# EAGLE design cft-tty-board (EAGLE 5.11)
DRAWN_BY: Alexios; PROJECT_NAME: CFT Mini-Computer; REVISION: Rev A; SHEET_DESCRIPTION: RS-232 Ports (16C550 UARTs); SIMULATION_FILENAME: To be coded; URL: http://www.bedroomlan.org/cft

## Sheet 1 of 3
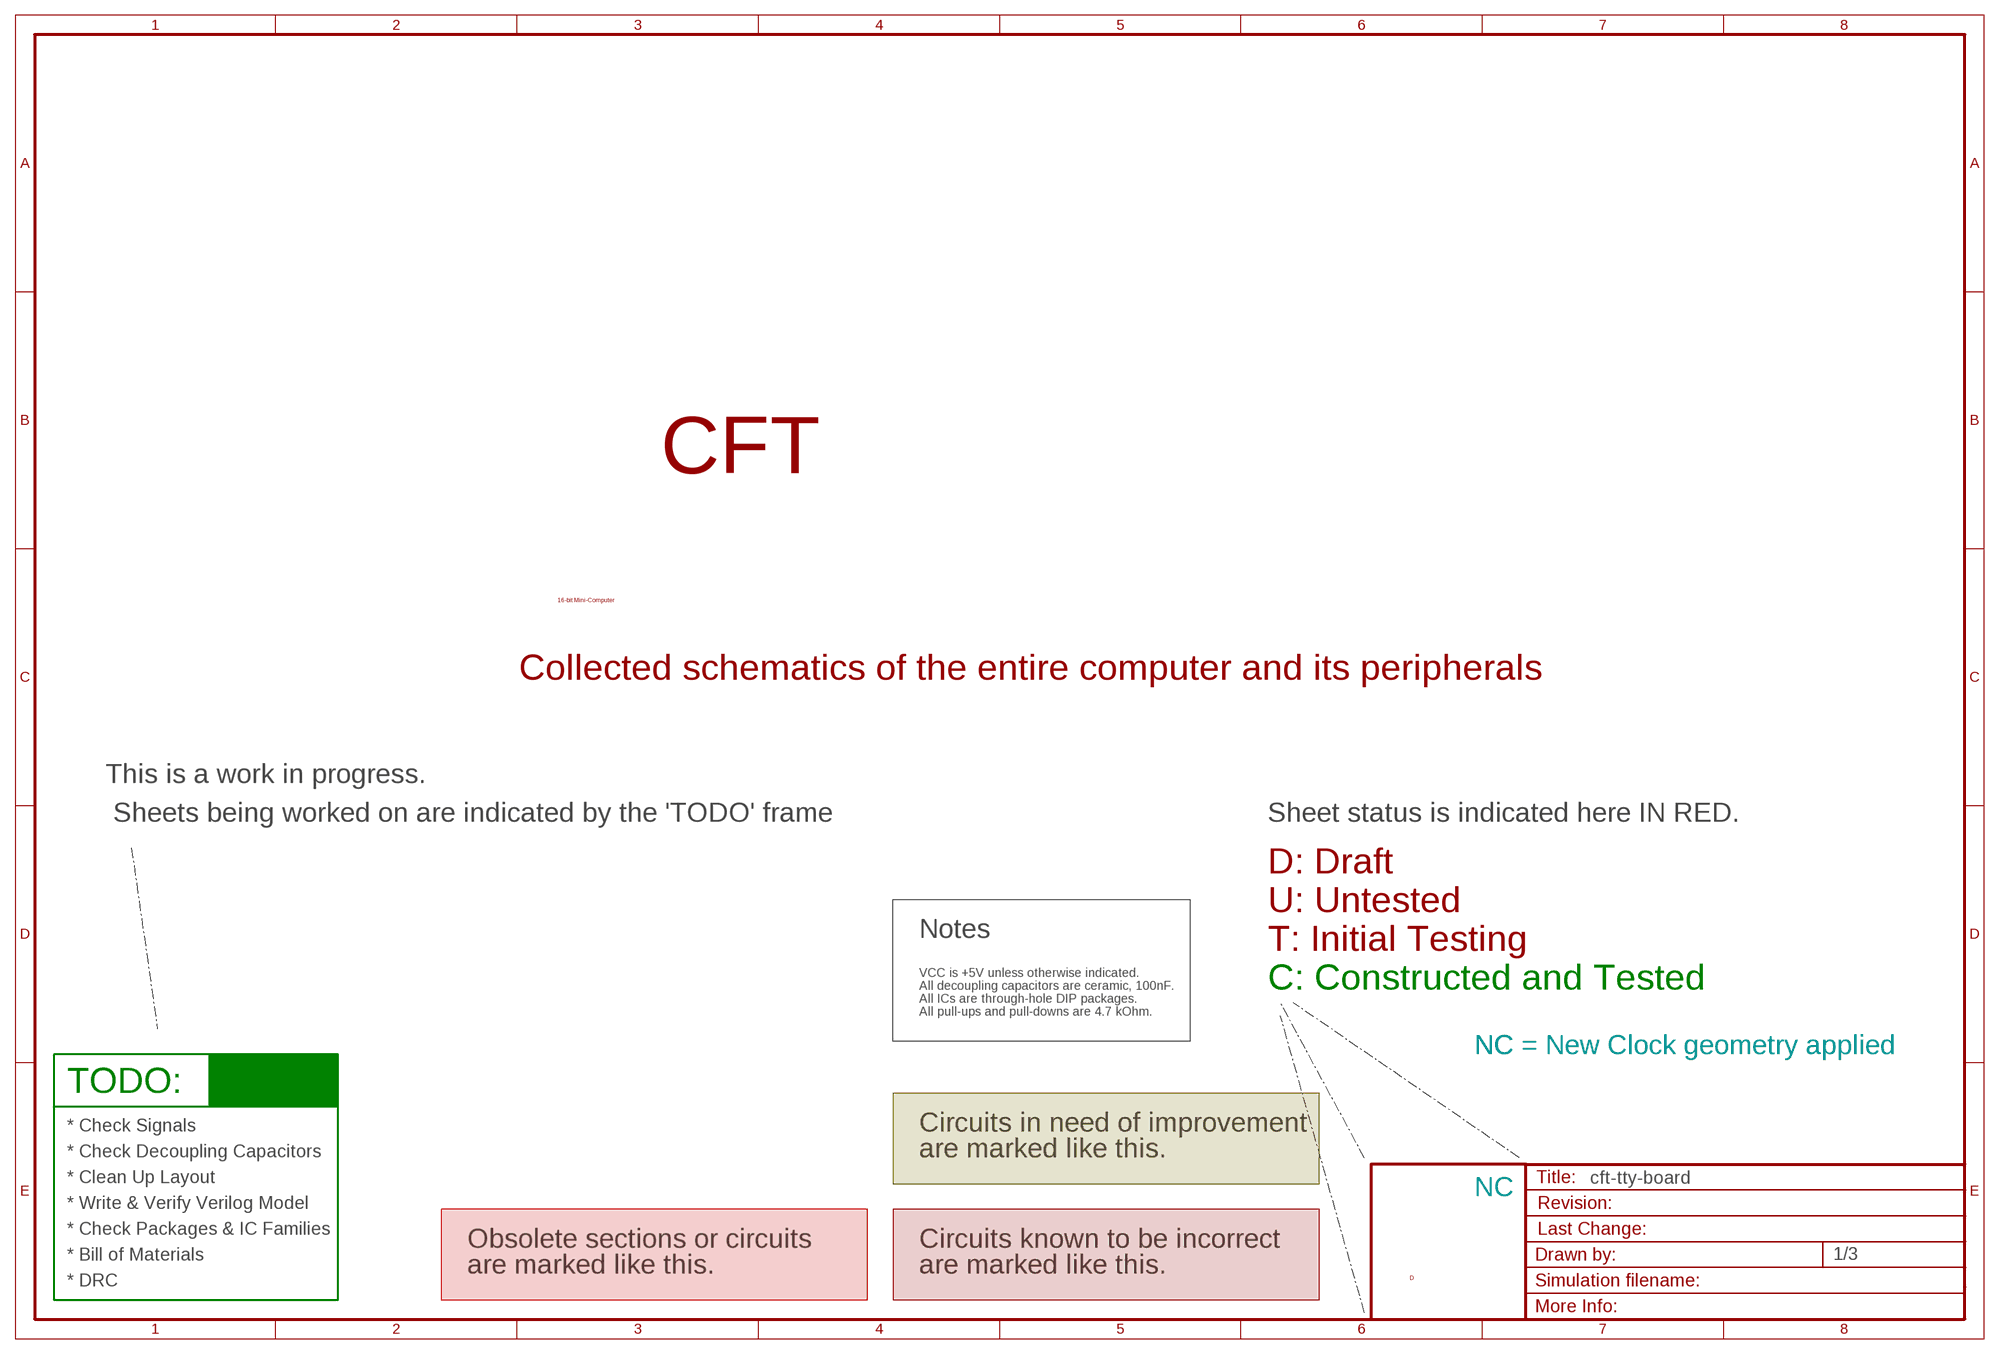
[diagram p0: schematic, sheet 1]

### Notes on the sheet
- CFT
- 16-bit Mini-Computer
- Collected schematics of the entire computer and its peripherals
- This is a work in progress.
- Sheets being worked on are indicated by the 'TODO' frame | Sheet status is indicated here IN RED.
- D: Draft
- U: Untested
- Notes
- T: Initial Testing
- VCC is +5V unless otherwise indicated.
- All decoupling capacitors are ceramic, 100nF. | C: Constructed and Tested
- All ICs are through-hole DIP packages.
- All pull-ups and pull-downs are 4.7 kOhm.
- NC | NC = New Clock geometry applied
- TODO:
- * Check Signals | Circuits in need of improvement
- * Check Decoupling Capacitors | are marked like this.
- * Clean Up Layout
- NC
- * Write & Verify Verilog Model
- * Check Packages & IC Families
- Obsolete sections or circuits | Circuits known to be incorrect
- * Bill of Materials
- are marked like this. | are marked like this.
- D
- * DRC

## Sheet 2 of 3
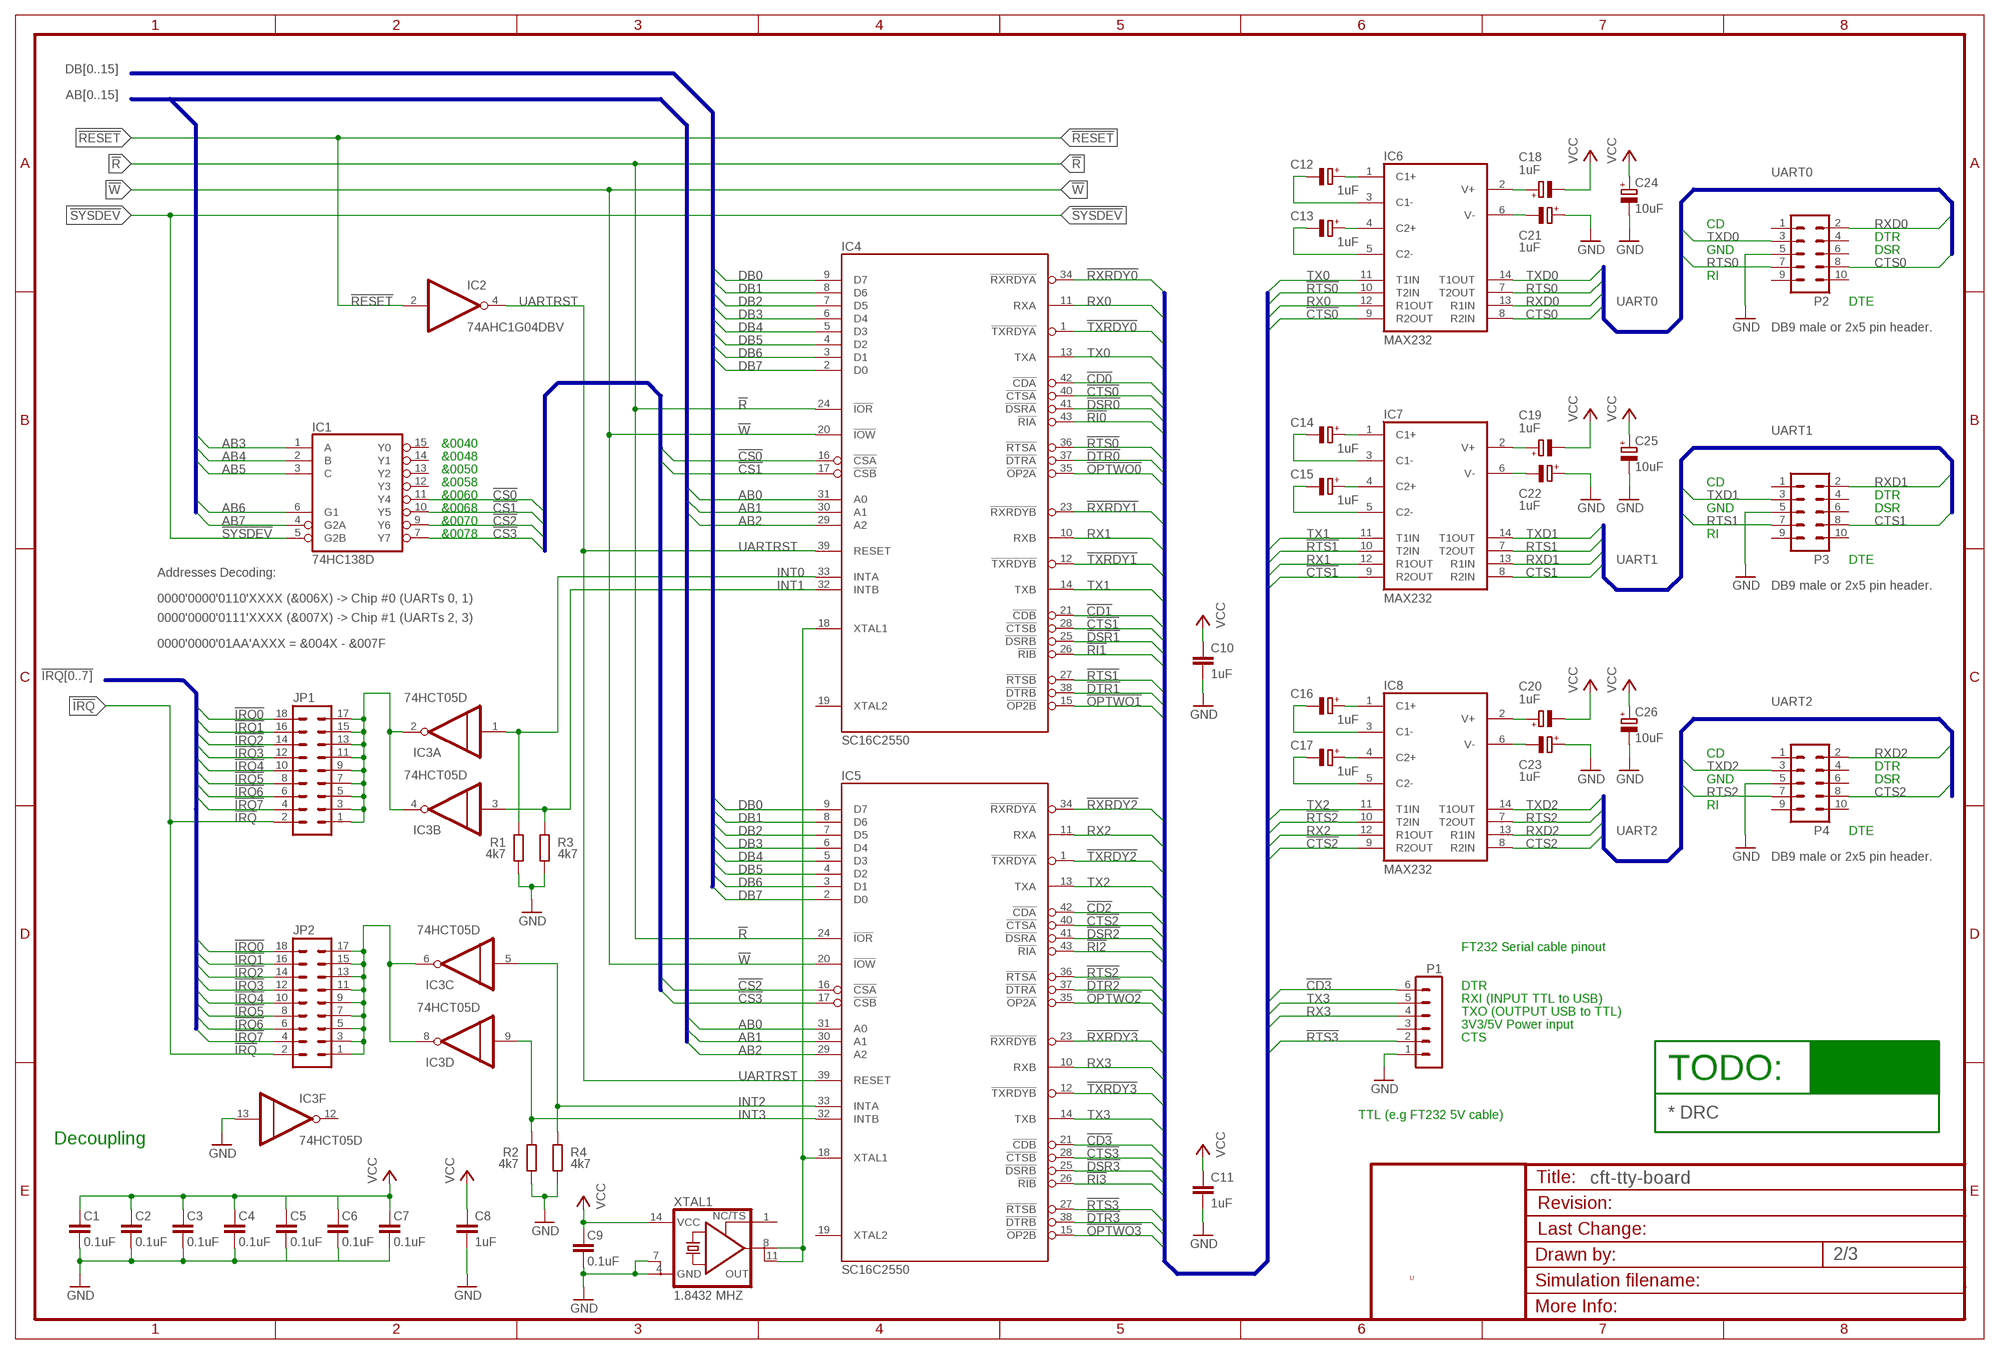
[diagram p1: schematic, sheet 2]

### Parts
C1  0.1uF  C-EUC0805K  [C0805K]
C2  0.1uF  C-EUC0805K  [C0805K]
C3  0.1uF  C-EUC0805K  [C0805K]
C4  0.1uF  C-EUC0805K  [C0805K]
C5  0.1uF  C-EUC0805K  [C0805K]
C6  0.1uF  C-EUC0805K  [C0805K]
C7  0.1uF  C-EUC0805K  [C0805K]
C8  1uF  C-EUC0805K  [C0805K]
C9  0.1uF  C-EUC0805K  [C0805K]
C10  1uF  C-EUC0805K  [C0805K]
C11  1uF  C-EUC0805K  [C0805K]
C12  1uF  CPOL-EUE2.5-5  [E2,5-5]
C13  1uF  CPOL-EUE2.5-5  [E2,5-5]
C14  1uF  CPOL-EUE2.5-5  [E2,5-5]
C15  1uF  CPOL-EUE2.5-5  [E2,5-5]
C16  1uF  CPOL-EUE2.5-5  [E2,5-5]
C17  1uF  CPOL-EUE2.5-5  [E2,5-5]
C18  1uF  CPOL-EUE2.5-5  [E2,5-5]
C19  1uF  CPOL-EUE2.5-5  [E2,5-5]
C20  1uF  CPOL-EUE2.5-5  [E2,5-5]
C21  1uF  CPOL-EUE2.5-5  [E2,5-5]
C22  1uF  CPOL-EUE2.5-5  [E2,5-5]
C23  1uF  CPOL-EUE2.5-5  [E2,5-5]
C24  10uF  CPOL-EUE2.5-5  [E2,5-5]
C25  10uF  CPOL-EUE2.5-5  [E2,5-5]
C26  10uF  CPOL-EUE2.5-5  [E2,5-5]
IC1  74HC138D  [SO16]
IC2  74AHC1G04DBV  [SOT23-5]
IC3  74HCT05D  [SO14]
IC4  SC16C2550  16C2550  [PLCC-S44-SOCKET]
IC5  SC16C2550  16C2550  [PLCC-S44-SOCKET]
IC6  MAX232  [DIL16]
IC7  MAX232  [DIL16]
IC8  MAX232  [DIL16]
JP1  MA09-2  [MA09-2]
JP2  MA09-2  [MA09-2]
P1  MA06-1  [MA06-1]
P2  MA05-2  [MA05-2]
P3  MA05-2  [MA05-2]
P4  MA05-2  [MA05-2]
R1  4k7  R-EU_M0805  [M0805]
R2  4k7  R-EU_M0805  [M0805]
R3  4k7  R-EU_M0805  [M0805]
R4  4k7  R-EU_M0805  [M0805]
XTAL1  1.8432 MHZ  XO2-08-14-SOCKET  [DIL0814S]

### Nets
!CD0: IC4.42(!CDA)
!CD1: IC4.21(!CDB)
!CD2: IC5.42(!CDA)
!CD3: IC5.21(!CDB) P1.6
!CS0: IC1.11(Y4) IC4.16(!CSA)
!CS1: IC1.10(Y5) IC4.17(!CSB)
!CS2: IC1.9(Y6) IC5.16(!CSA)
!CS3: IC1.7(Y7) IC5.17(!CSB)
!CTS0: IC4.40(!CTSA) IC6.9(R2OUT)
!CTS1: IC4.28(!CTSB) IC7.9(R2OUT)
!CTS2: IC5.40(!CTSA) IC8.9(R2OUT)
!CTS3: IC5.28(!CTSB)
!DSR0: IC4.41(!DSRA)
!DSR1: IC4.25(!DSRB)
!DSR2: IC5.41(!DSRA)
!DSR3: IC5.25(!DSRB)
!DTR0: IC4.37(!DTRA)
!DTR1: IC4.38(!DTRB)
!DTR2: IC5.37(!DTRA)
!DTR3: IC5.38(!DTRB)
!INTRN0: IC3.2(A:O) IC3.4(B:O) JP1.1 JP1.3 JP1.5 JP1.7 JP1.9 JP1.11 JP1.13 JP1.15 JP1.17
!INTRN1: IC3.6(C:O) IC3.8(D:O) JP2.1 JP2.3 JP2.5 JP2.7 JP2.9 JP2.11 JP2.13 JP2.15 JP2.17
!IRQ: JP1.2 JP2.2 ; also sheet 3
!IRQ0: JP1.18 JP2.18 ; also sheet 3
!IRQ1: JP1.16 JP2.16 ; also sheet 3
!IRQ2: JP1.14 JP2.14 ; also sheet 3
!IRQ3: JP1.12 JP2.12 ; also sheet 3
!IRQ4: JP1.10 JP2.10 ; also sheet 3
!IRQ5: JP1.8 JP2.8 ; also sheet 3
!IRQ6: JP1.6 JP2.6 ; also sheet 3
!IRQ7: JP1.4 JP2.4 ; also sheet 3
!OPTWO0: IC4.35(!OP2A)
!OPTWO1: IC4.15(!OP2B)
!OPTWO2: IC5.35(!OP2A)
!OPTWO3: IC5.15(!OP2B)
!R: IC4.24(!IOR) IC5.24(!IOR) ; also sheet 3
!RESET: IC2.2(I) ; also sheet 3
!RI0: IC4.43(!RIA)
!RI1: IC4.26(!RIB)
!RI2: IC5.43(!RIA)
!RI3: IC5.26(!RIB)
!RTS0: IC4.36(!RTSA) IC6.10(T2IN)
!RTS1: IC4.27(!RTSB) IC7.10(T2IN)
!RTS2: IC5.36(!RTSA) IC8.10(T2IN)
!RTS3: IC5.27(!RTSB) P1.2
!RXRDY0: IC4.34(!RXRDYA)
!RXRDY1: IC4.23(!RXRDYB)
!RXRDY2: IC5.34(!RXRDYA)
!RXRDY3: IC5.23(!RXRDYB)
!SYSDEV: IC1.5(G2B) ; also sheet 3
!TXRDY0: IC4.1(!TXRDYA)
!TXRDY1: IC4.12(!TXRDYB)
!TXRDY2: IC5.1(!TXRDYA)
!TXRDY3: IC5.12(!TXRDYB)
!W: IC4.20(!IOW) IC5.20(!IOW) ; also sheet 3
AB0: IC4.31(A0) IC5.31(A0) ; also sheet 3
AB1: IC4.30(A1) IC5.30(A1) ; also sheet 3
AB2: IC4.29(A2) IC5.29(A2) ; also sheet 3
AB3: IC1.1(A) ; also sheet 3
AB4: IC1.2(B) ; also sheet 3
AB5: IC1.3(C) ; also sheet 3
AB6: IC1.6(G1) ; also sheet 3
AB7: IC1.4(G2A) ; also sheet 3
CTS0: IC6.8(R2IN) P2.8
CTS1: IC7.8(R2IN) P3.8
CTS2: IC8.8(R2IN) P4.8
DB0: IC4.9(D7) IC5.9(D7) ; also sheet 3
DB1: IC4.8(D6) IC5.8(D6) ; also sheet 3
DB2: IC4.7(D5) IC5.7(D5) ; also sheet 3
DB3: IC4.6(D4) IC5.6(D4) ; also sheet 3
DB4: IC4.5(D3) IC5.5(D3) ; also sheet 3
DB5: IC4.4(D2) IC5.4(D2) ; also sheet 3
DB6: IC4.3(D1) IC5.3(D1) ; also sheet 3
DB7: IC4.2(D0) IC5.2(D0) ; also sheet 3
GND [low power]: C1.1 C2.1 C3.1 C4.1 C5.1 C6.1 C7.1 C8.2 C9.1 C10.2 C11.2 C21.+ C22.+ C23.+ C24.- C25.- C26.- IC3.13(F:I) P1.1 P2.5 P3.5 P4.5 R1.1 R2.1 R3.1 R4.1 XTAL1.4(GND) XTAL1.7(GND1) ; also sheet 3
INT0: IC3.1(A:I) IC4.33(INTA) R1.2
INT1: IC3.3(B:I) IC4.32(INTB) R3.2
INT2: IC3.5(C:I) IC5.33(INTA) R4.2
INT3: IC3.9(D:I) IC5.32(INTB) R2.2
N$829: C12.+ IC6.1(C1+)
N$830: C12.- IC6.3(C1-)
N$831: C13.+ IC6.4(C2+)
N$832: C13.- IC6.5(C2-)
N$833: C21.- IC6.6(V-)
N$834: C18.+ IC6.2(V+)
N$836: C14.+ IC7.1(C1+)
N$837: C14.- IC7.3(C1-)
N$838: C15.+ IC7.4(C2+)
N$839: C15.- IC7.5(C2-)
N$840: C22.- IC7.6(V-)
N$841: C19.+ IC7.2(V+)
N$851: C16.+ IC8.1(C1+)
N$852: C16.- IC8.3(C1-)
N$853: C17.+ IC8.4(C2+)
N$854: C17.- IC8.5(C2-)
N$855: C23.- IC8.6(V-)
N$856: C20.+ IC8.2(V+)
RTS0: IC6.7(T2OUT) P2.7
RTS1: IC7.7(T2OUT) P3.7
RTS2: IC8.7(T2OUT) P4.7
RX0: IC4.11(RXA) IC6.12(R1OUT)
RX1: IC4.10(RXB) IC7.12(R1OUT)
RX2: IC5.11(RXA) IC8.12(R1OUT)
RX3: IC5.10(RXB) P1.4
RXD0: IC6.13(R1IN) P2.2
RXD1: IC7.13(R1IN) P3.2
RXD2: IC8.13(R1IN) P4.2
TX0: IC4.13(TXA) IC6.11(T1IN)
TX1: IC4.14(TXB) IC7.11(T1IN)
TX2: IC5.13(TXA) IC8.11(T1IN)
TX3: IC5.14(TXB) P1.5
TXD0: IC6.14(T1OUT) P2.3
TXD1: IC7.14(T1OUT) P3.3
TXD2: IC8.14(T1OUT) P4.3
UARTCLK: IC4.18(XTAL1) IC5.18(XTAL1) XTAL1.8(OUT) XTAL1.11(OUT1)
UARTRST: IC2.4(O) IC4.39(RESET) IC5.39(RESET)
VCC [low power]: C1.2 C2.2 C3.2 C4.2 C5.2 C6.2 C7.2 C8.1 C9.2 C10.1 C11.1 C18.- C19.- C20.- C24.+ C25.+ C26.+ XTAL1.14(VCC) ; also sheet 3
Unconnected: IC1.12(Y3) IC1.13(Y2) IC1.14(Y1) IC1.15(Y0) IC3.10(E:O) IC3.11(E:I) IC3.12(F:O) IC4.19(XTAL2) IC5.19(XTAL2) P1.3 P2.1 P2.4 P2.6 P2.9 P2.10 P3.1 P3.4 P3.6 P3.9 P3.10 P4.1 P4.4 P4.6 P4.9 P4.10 XTAL1.1(TS)

### Buses
DB[0..15]
AB[0..15]
!IRQ[0..7]
UART0
UART1
UART2
!CS[0..3]
!RXRDY[0..3],!TXRDY[0..3],RX[0..3],TX[0..3],!CD[0..3],!CTS[0..3],!DSR[0..3],!RI[0..3],!RTS[0..3],!DTR[0..3],!OPTWO[0..3]

### Notes on the sheet
- CD
- DTR
- GND | DSR
- RI
- DTE
- DB9 male or 2x5 pin header.
- &0040
- &0048
- &0050
- &0058 | CD
- &0060 | DTR
- &0068 | GND | DSR
- &0070
- &0078 | RI
- DTE
- Addresses Decoding:
- DB9 male or 2x5 pin header.
- 0000'0000'0110'XXXX (&006X) -> Chip #0 (UARTs 0, 1)
- 0000'0000'0111'XXXX (&007X) -> Chip #1 (UARTs 2, 3)
- 0000'0000'01AA'AXXX = &004X - &007F
- CD
- DTR
- GND | DSR
- RI
- DTE
- DB9 male or 2x5 pin header.
- FT232 Serial cable pinout
- DTR
- RXI (INPUT TTL to USB)
- TXO (OUTPUT USB to TTL)
- 3V3/5V Power input
- CTS
- TODO:
- TTL (e.g FT232 5V cable) | * DRC
- Decoupling
- U

## Sheet 3 of 3
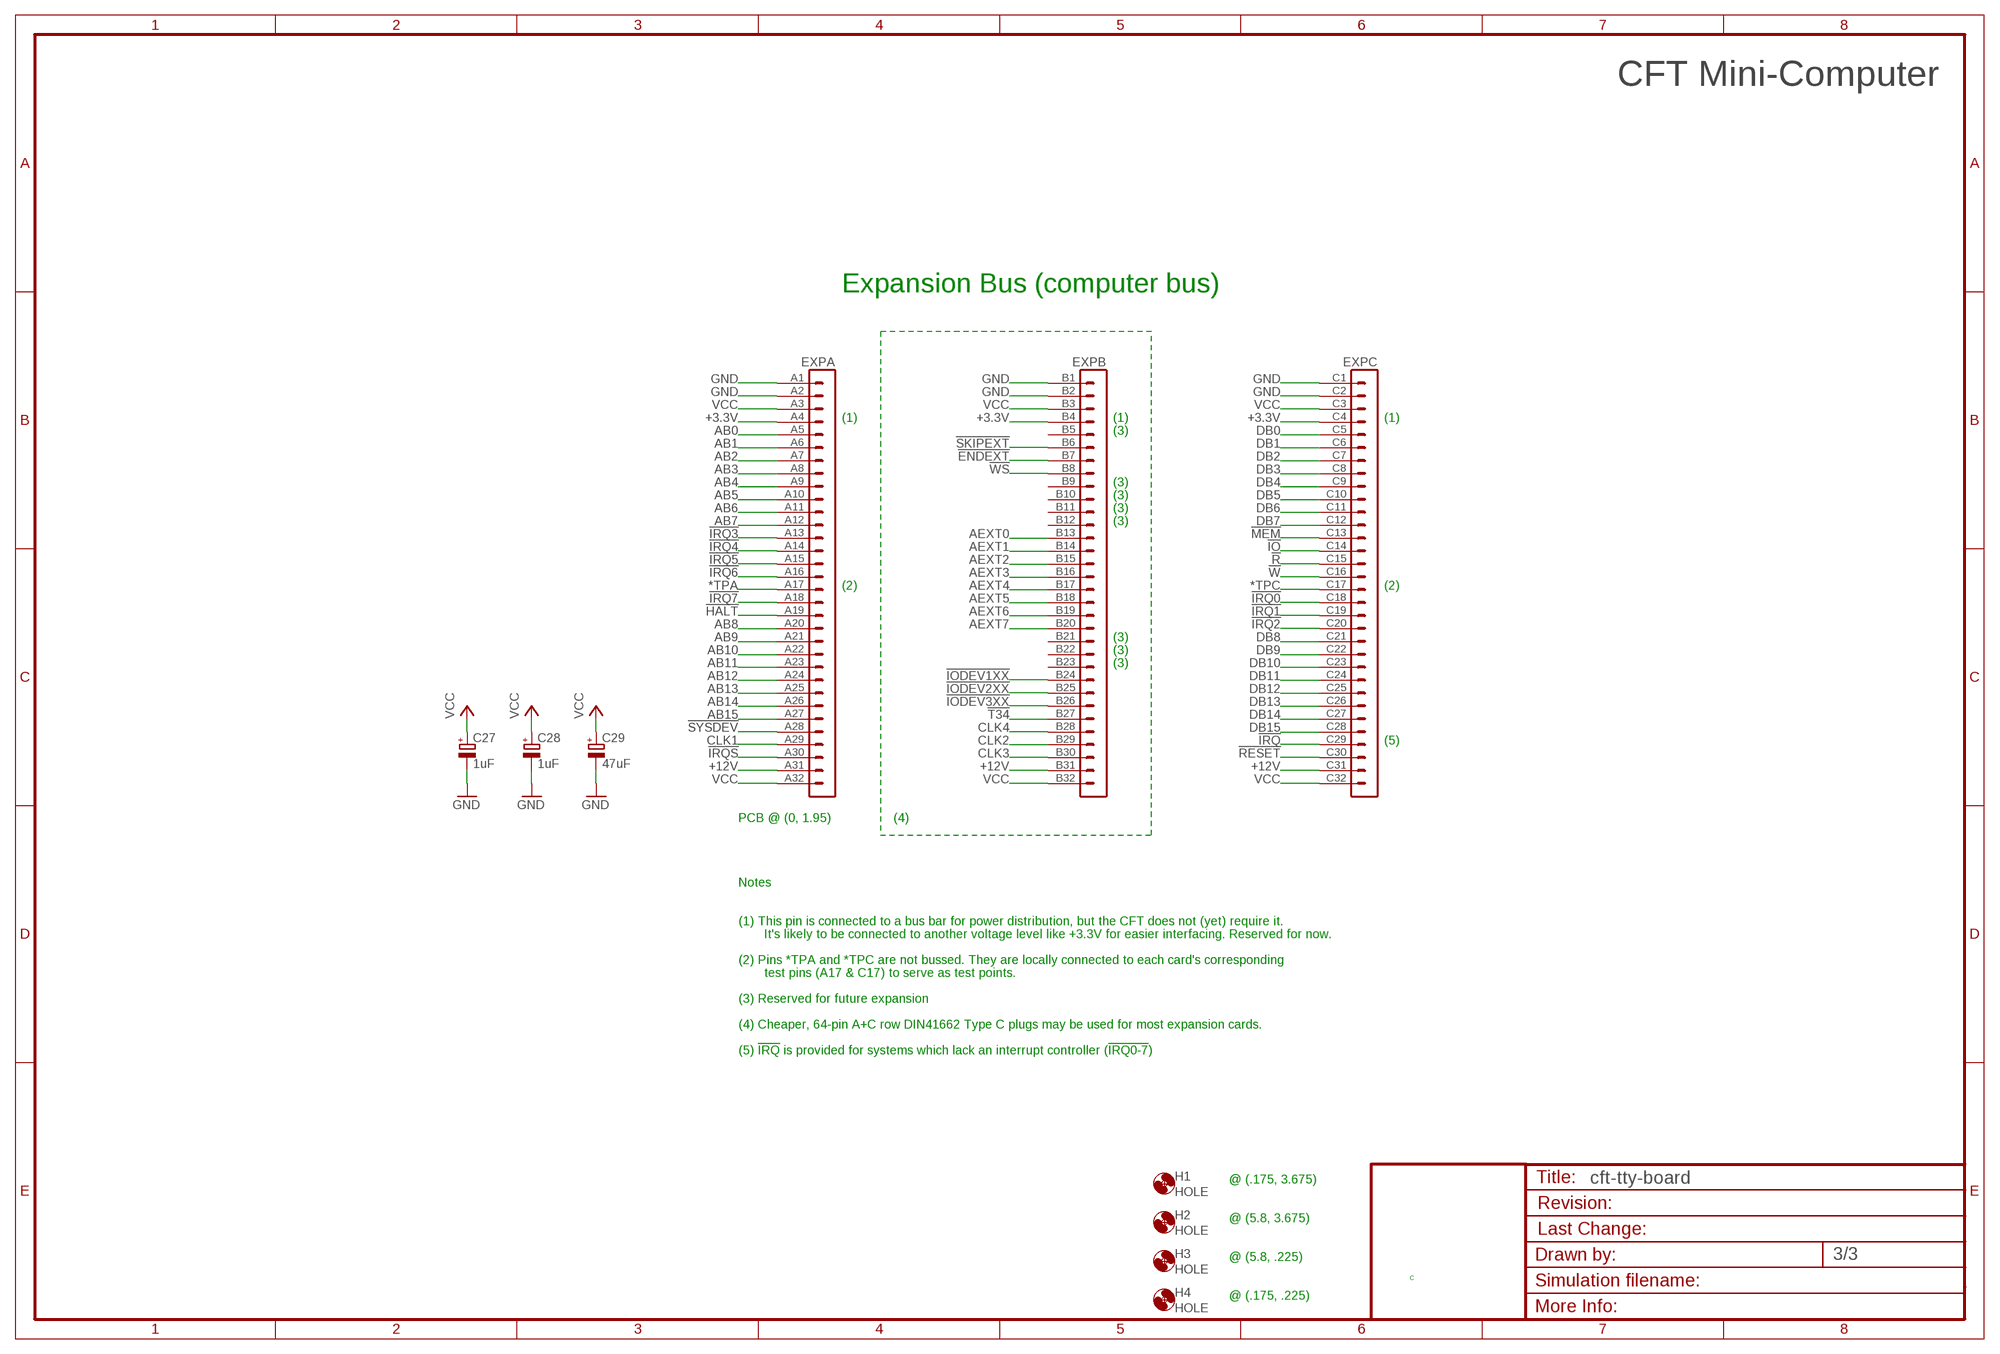
[diagram p2: schematic, sheet 3]

### Parts
C27  1uF  CPOL-EUE2.5-5  [E2,5-5]
C28  1uF  CPOL-EUE2.5-5  [E2,5-5]
C29  47uF  CPOL-EUE2.5-5  [E2,5-5]
EXP  VG96-3K  [VG96K]
H1  HOLE  [STANDOFF_28_60]
H2  HOLE  [STANDOFF_28_60]
H3  HOLE  [STANDOFF_28_60]
H4  HOLE  [STANDOFF_28_60]

### Nets
!ENDEXT: EXP.B7
!HALT: EXP.A19
!IO: EXP.C14
!IODEV1XX: EXP.B24
!IODEV2XX: EXP.B25
!IODEV3XX: EXP.B26
!IRQ: EXP.C29 ; also sheet 2
!IRQ0: EXP.C18 ; also sheet 2
!IRQ1: EXP.C19 ; also sheet 2
!IRQ2: EXP.C20 ; also sheet 2
!IRQ3: EXP.A13 ; also sheet 2
!IRQ4: EXP.A14 ; also sheet 2
!IRQ5: EXP.A15 ; also sheet 2
!IRQ6: EXP.A16 ; also sheet 2
!IRQ7: EXP.A18 ; also sheet 2
!IRQS: EXP.A30
!MEM: EXP.C13
!R: EXP.C15 ; also sheet 2
!RESET: EXP.C30 ; also sheet 2
!SKIPEXT: EXP.B6
!SYSDEV: EXP.A28 ; also sheet 2
!T34: EXP.B27
!W: EXP.C16 ; also sheet 2
!WS: EXP.B8
*TPA: EXP.A17
*TPC: EXP.C17
+3.3V: EXP.A4 EXP.B4 EXP.C4
+12V [LED power]: EXP.A31 EXP.B31 EXP.C31
AB0: EXP.A5 ; also sheet 2
AB1: EXP.A6 ; also sheet 2
AB2: EXP.A7 ; also sheet 2
AB3: EXP.A8 ; also sheet 2
AB4: EXP.A9 ; also sheet 2
AB5: EXP.A10 ; also sheet 2
AB6: EXP.A11 ; also sheet 2
AB7: EXP.A12 ; also sheet 2
AB8: EXP.A20
AB9: EXP.A21
AB10: EXP.A22
AB11: EXP.A23
AB12: EXP.A24
AB13: EXP.A25
AB14: EXP.A26
AB15: EXP.A27
AEXT0: EXP.B13
AEXT1: EXP.B14
AEXT2: EXP.B15
AEXT3: EXP.B16
AEXT4: EXP.B17
AEXT5: EXP.B18
AEXT6: EXP.B19
AEXT7: EXP.B20
CLK1: EXP.A29
CLK2: EXP.B29
CLK3: EXP.B30
CLK4: EXP.B28
DB0: EXP.C5 ; also sheet 2
DB1: EXP.C6 ; also sheet 2
DB2: EXP.C7 ; also sheet 2
DB3: EXP.C8 ; also sheet 2
DB4: EXP.C9 ; also sheet 2
DB5: EXP.C10 ; also sheet 2
DB6: EXP.C11 ; also sheet 2
DB7: EXP.C12 ; also sheet 2
DB8: EXP.C21
DB9: EXP.C22
DB10: EXP.C23
DB11: EXP.C24
DB12: EXP.C25
DB13: EXP.C26
DB14: EXP.C27
DB15: EXP.C28
GND [low power]: C27.- C28.- C29.- EXP.A1 EXP.A2 EXP.B1 EXP.B2 EXP.C1 EXP.C2 ; also sheet 2
VCC [low power]: C27.+ C28.+ C29.+ EXP.A3 EXP.A32 EXP.B3 EXP.B32 EXP.C3 EXP.C32 ; also sheet 2
Unconnected: EXP.B5 EXP.B9 EXP.B10 EXP.B11 EXP.B12 EXP.B21 EXP.B22 EXP.B23

### Notes on the sheet
- CFT Mini-Computer
- Expansion Bus (computer bus)
- (1) | (1) | (1)
- (3)
- (3)
- (3)
- (3)
- (3)
- (2) | (2)
- (3)
- (3)
- (3)
- (5)
- PCB @ (0, 1.95) | (4)
- Notes
- (1) This pin is connected to a bus bar for power distribution, but the CFT does not (yet) require it.
- It's likely to be connected to another voltage level like +3.3V for easier interfacing. Reserved for now.
- (2) Pins *TPA and *TPC are not bussed. They are locally connected to each card's corresponding
- test pins (A17 & C17) to serve as test points.
- (3) Reserved for future expansion
- (4) Cheaper, 64-pin A+C row DIN41662 Type C plugs may be used for most expansion cards.
- (5) !IRQ! is provided for systems which lack an interrupt controller (!IRQ0-7!)
- @ (.175, 3.675)
- @ (5.8, 3.675)
- @ (5.8, .225)
- C
- @ (.175, .225)

## Power pins joined to a net without a drawn wire
GND: IC1.8(GND) IC2.3(GND) IC3.7(P:GND) IC4.22(GND) IC5.22(GND) IC6.15(GND) IC7.15(GND) IC8.15(GND)
VCC: IC1.16(VCC) IC2.5(VCC) IC3.14(P:VCC) IC4.44(VCC) IC5.44(VCC) IC6.16(VCC) IC7.16(VCC) IC8.16(VCC)

## Library data of the parts
C1-C11 = rcl:C-EU: CAPACITOR, European symbol
C12-C29 = rcl:CPOL-EU: POLARIZED CAPACITOR, European symbol
EXP = alexios-19inch:VG96-3: PCB EUROCARD, 96-pin type C/ABC, 2.54 mm
H1-H4 = alexios:HOLE: Hole for a standoff or mount. Hole diameter: 3.3mm. External Diameter: 6mm.
IC1 = 74xx-eu:74*138: 3-line to 8-line DECODER/DEMULTIPLEXER
IC2 = alexios:74*1G04: INVERTER Gate
IC3 = alexios:74*05: Hex INVERTER, open collector/drain
IC4 IC5 = alexios:16C2550: 16C2550 Dual 16550 UART 5 V, 3.3 V and 2.5 V dual UART, 5 Mbit/s (max.), with 16-byte FIFOs E.g. SC16C2550B.
IC6-IC8 = maxim:MAX232: RS232 TRANSEIVER; MF: MAXIM; MPN: MAX232ACPE+; OC_FARNELL: 9723773; OC_NEWARK: 68K4544
JP1 JP2 = con-lstb:MA09-2: PIN HEADER; OC_FARNELL: unknown; OC_NEWARK: unknown
P1 = con-lstb:MA06-1: PIN HEADER; OC_FARNELL: unknown; OC_NEWARK: unknown
P2-P4 = con-lstb:MA05-2: PIN HEADER; OC_FARNELL: unknown; OC_NEWARK: unknown
R1-R4 = resistor:R-EU_: RESISTOR, European symbol
XTAL1 = alexios:XO2-: Crystal Oscillator Crystal oscillator compatible with both DIL14 and DIL08 packages, with or without sockets.

## Net classes
0 default: width 0.305 mm, clearance 0.203 mm
1 low power: width 1.27 mm, clearance 0.254 mm
2 LED power: width 1.93 mm, clearance 0.254 mm

## Board
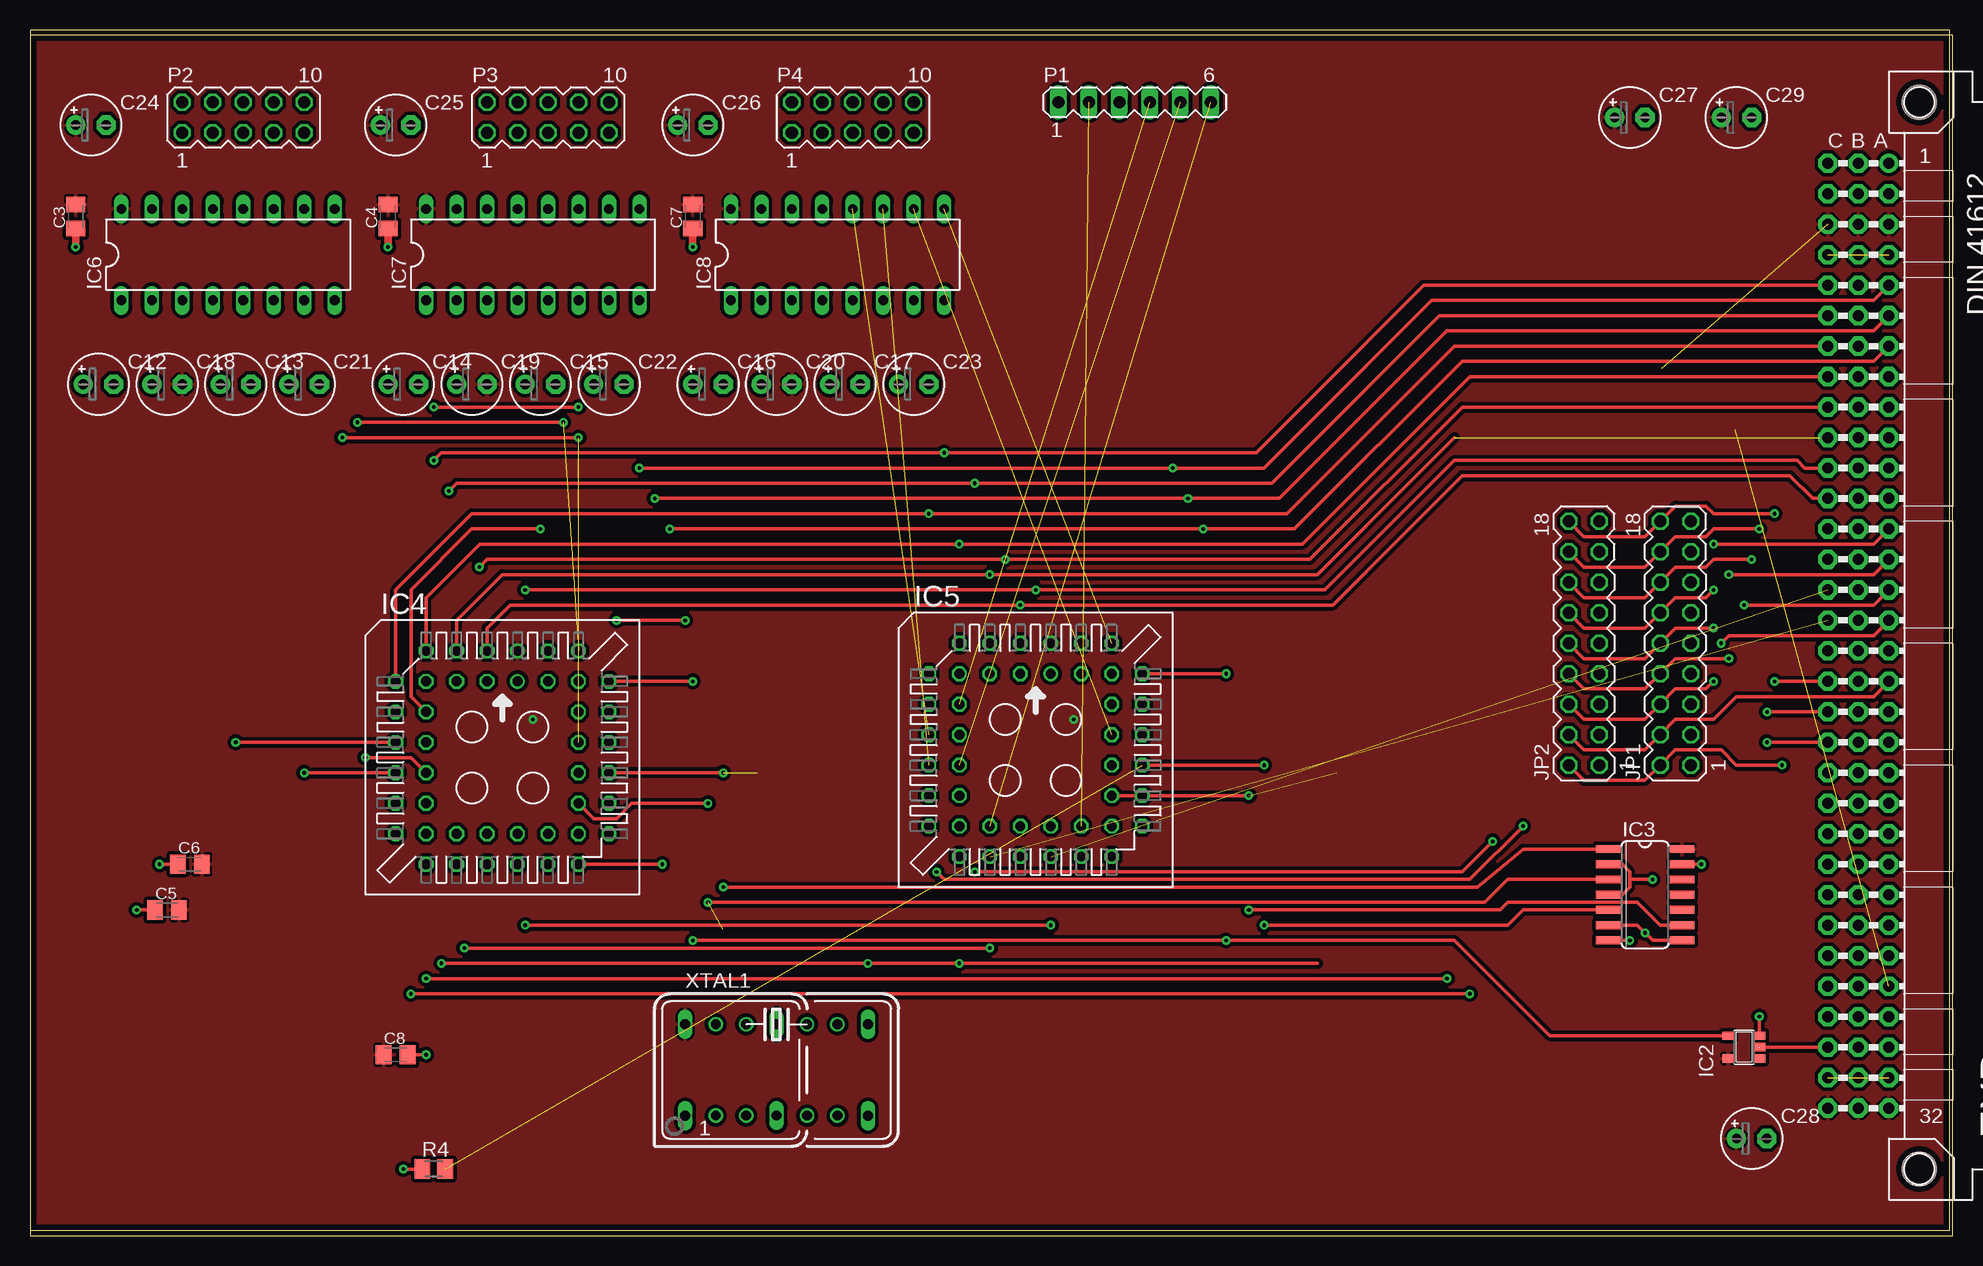
[diagram p3: board, top side]
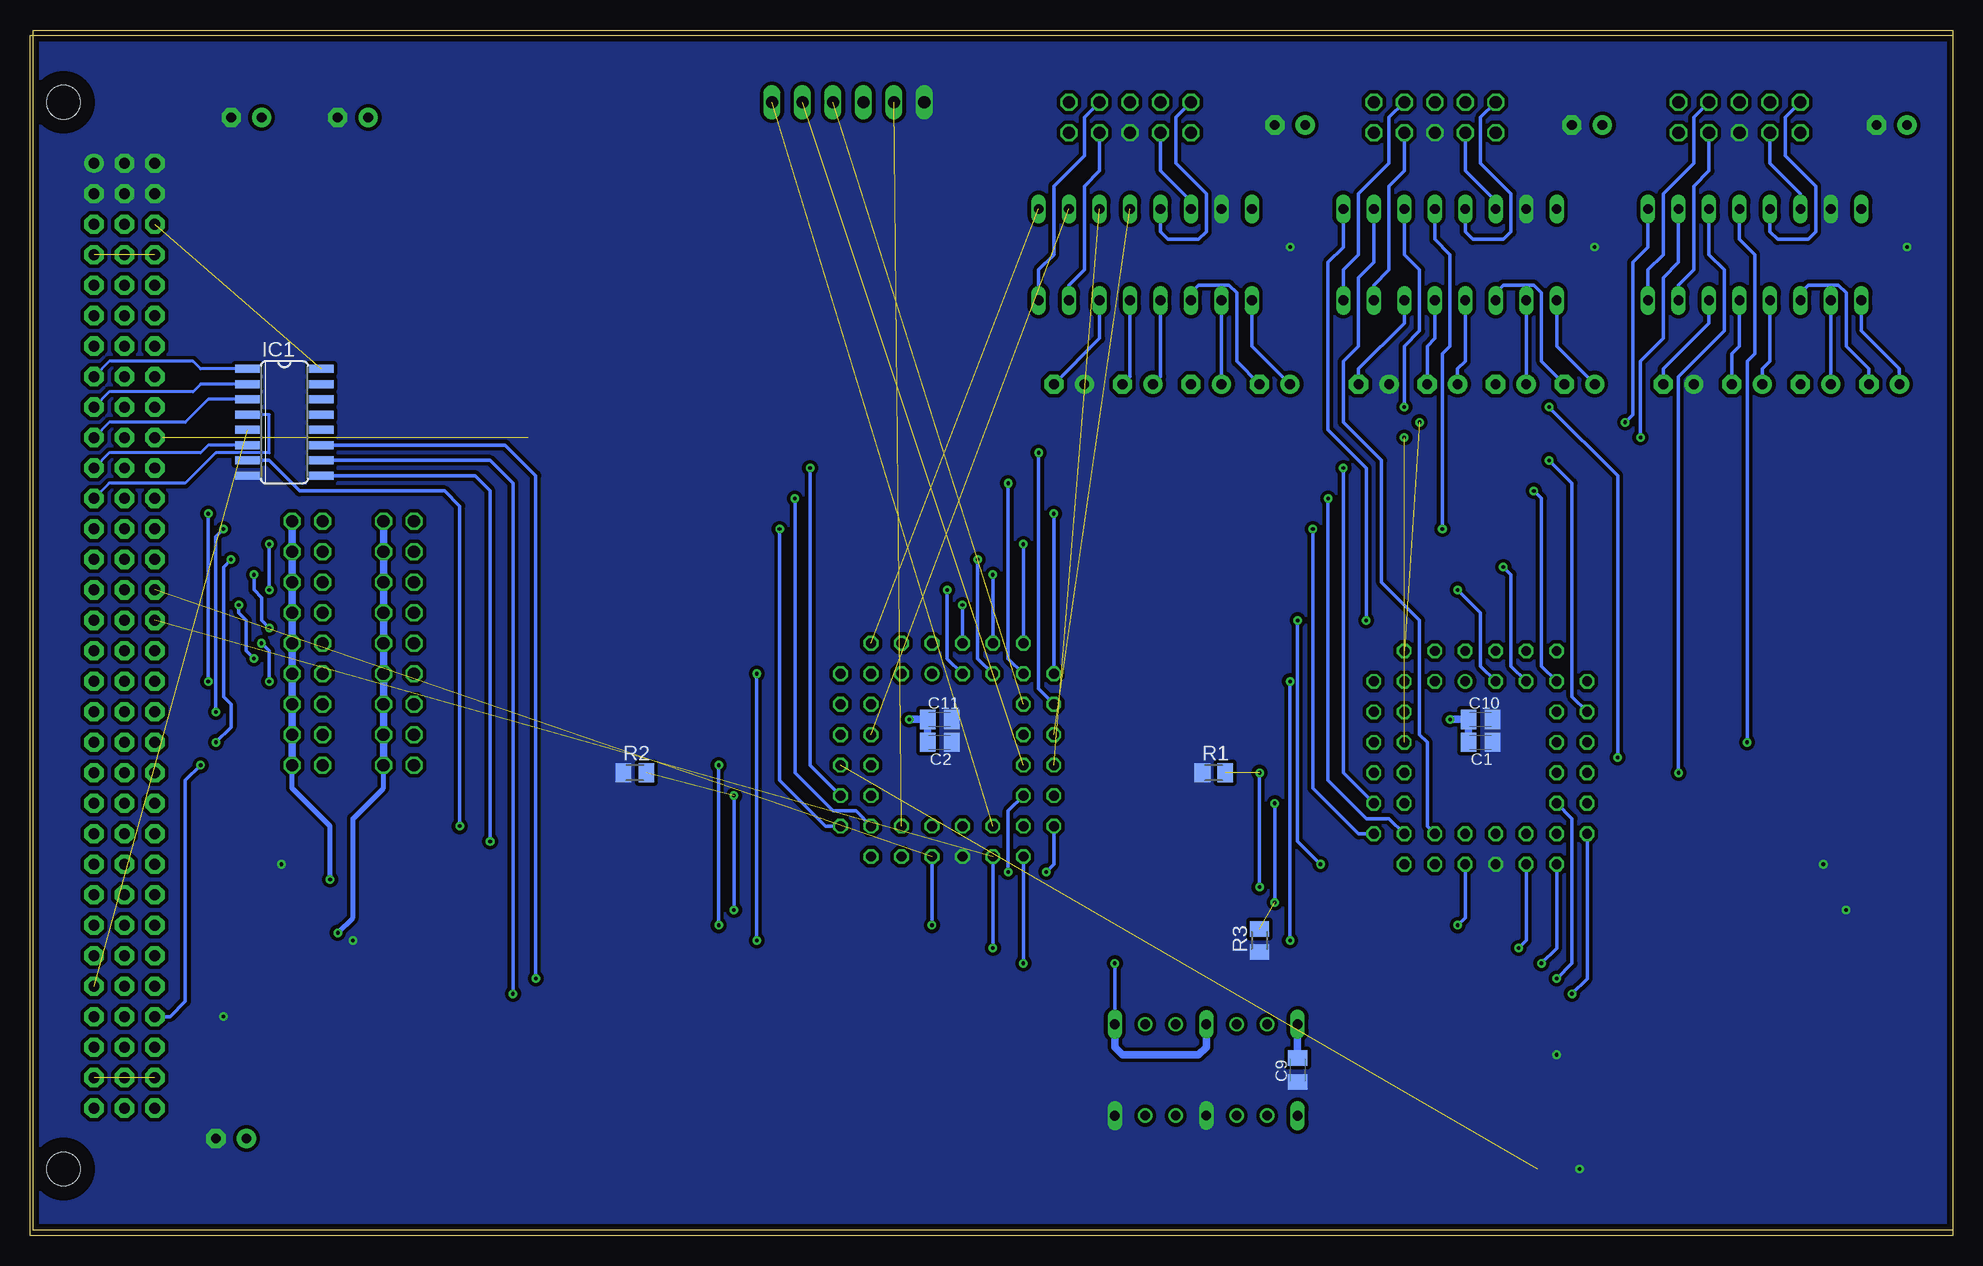
[diagram p4: board, bottom side, seen from below]

Size 160 x 100 mm. Coordinates in mm from the lower left corner, seen from the top.
Outline: 0,0 160,0 160,100 0,100 0,0
Copper layers (1*16): Top 0.035mm / dielectric 0.2mm / Bottom 0.035mm
Design rules "MyroPCB-8mil-prototyping": minimum track width 8mil, minimum drill 12mil, track to track 8mil, track to pad 8mil, pad to pad 8mil, via to via 8mil, smd to smd 8mil, copper to edge 20mil, drill to drill 8mil, minimum pad ring 8mil, minimum via ring 8mil, stop-mask expansion 4mil, vias tented up to drill 0mil, thermal gap 8mil

### Footprints (pad centres in the part's own frame; a part is rotated, then mirrored left to right if it is on the bottom)
C0805K = smd 1.3 x 1.6: 1 -1,0; 2 1,0
E2,5-5 = drill 0.813 pad 1.6 round: + -1.27,0 | drill 0.813 pad 1.6 octagon: - 1.27,0
VG96K = drill 0.914 pad 1.6 round: A1 154.94,39.37 | drill 0.914 pad 1.6 octagon: A2 154.94,36.83; A3 154.94,34.29; A4 154.94,31.75; A5 154.94,29.21; A6 154.94,26.67; A7 154.94,24.13; A8 154.94,21.59; A9 154.94,19.05; A10 154.94,16.51; A11 154.94,13.97; A12 154.94,11.43; A13 154.94,8.89; A14 154.94,6.35; A15 154.94,3.81; A16 154.94,1.27; A17 154.94,-1.27; A18 154.94,-3.81; A19 154.94,-6.35; A20 154.94,-8.89; A21 154.94,-11.43; A22 154.94,-13.97; A23 154.94,-16.51; A24 154.94,-19.05; A25 154.94,-21.59; A26 154.94,-24.13; A27 154.94,-26.67; A28 154.94,-29.21; A29 154.94,-31.75; A30 154.94,-34.29; A31 154.94,-36.83; A32 154.94,-39.37; B1 152.4,39.37; B2 152.4,36.83; B3 152.4,34.29; B4 152.4,31.75; B5 152.4,29.21; B6 152.4,26.67; B7 152.4,24.13; B8 152.4,21.59; B9 152.4,19.05; B10 152.4,16.51; B11 152.4,13.97; B12 152.4,11.43; B13 152.4,8.89; B14 152.4,6.35; B15 152.4,3.81; B16 152.4,1.27; B17 152.4,-1.27; B18 152.4,-3.81; B19 152.4,-6.35; B20 152.4,-8.89; B21 152.4,-11.43; B22 152.4,-13.97; B23 152.4,-16.51; B24 152.4,-19.05; B25 152.4,-21.59; B26 152.4,-24.13; B27 152.4,-26.67; B28 152.4,-29.21; B29 152.4,-31.75; B30 152.4,-34.29; B31 152.4,-36.83; B32 152.4,-39.37; C1 149.86,39.37; C2 149.86,36.83; C3 149.86,34.29; C4 149.86,31.75; C5 149.86,29.21; C6 149.86,26.67; C7 149.86,24.13; C8 149.86,21.59; C9 149.86,19.05; C10 149.86,16.51; C11 149.86,13.97; C12 149.86,11.43; C13 149.86,8.89; C14 149.86,6.35; C15 149.86,3.81; C16 149.86,1.27; C17 149.86,-1.27; C18 149.86,-3.81; C19 149.86,-6.35; C20 149.86,-8.89; C21 149.86,-11.43; C22 149.86,-13.97; C23 149.86,-16.51; C24 149.86,-19.05; C25 149.86,-21.59; C26 149.86,-24.13; C27 149.86,-26.67; C28 149.86,-29.21; C29 149.86,-31.75; C30 149.86,-34.29; C31 149.86,-36.83; C32 149.86,-39.37 | hole 2.794: 157.48,44.45; 157.48,-44.45
STANDOFF_28_60 = hole 3.302: 0,0
SO16 = smd 0.66 x 2.032: 1 -4.445,-3.073; 2 -3.175,-3.073; 3 -1.905,-3.073; 4 -0.635,-3.073; 5 0.635,-3.073; 6 1.905,-3.073; 7 3.175,-3.073; 8 4.445,-3.073; 9 4.445,3.073; 10 3.175,3.073; 11 1.905,3.073; 12 0.635,3.073; 13 -0.635,3.073; 14 -1.905,3.073; 15 -3.175,3.073; 16 -4.445,3.073
SOT23-5 = smd 0.69 x 0.99: 1 -0.95,-1.29; 2 0,-1.29; 3 0.95,-1.29; 4 0.95,1.3; 5 -0.95,1.3
SO14 = smd 0.66 x 2.032: 1 -3.81,-3.073; 2 -2.54,-3.073; 3 -1.27,-3.073; 4 0,-3.073; 5 1.27,-3.073; 6 2.54,-3.073; 7 3.81,-3.073; 8 3.81,3.073; 9 2.54,3.073; 10 1.27,3.073; 11 0,3.073; 12 -1.27,3.073; 13 -2.54,3.073; 14 -3.81,3.073
PLCC-S44-SOCKET = drill 0.813 round: 1 1.27,6.35 | drill 0.813 octagon: 2 -1.27,8.89; 3 -1.27,6.35; 4 -3.81,8.89; 5 -3.81,6.35; 6 -6.35,8.89; 7 -8.89,6.35; 8 -6.35,6.35; 9 -8.89,3.81; 10 -6.35,3.81; 11 -8.89,1.27; 12 -6.35,1.27; 13 -8.89,-1.27; 14 -6.35,-1.27; 15 -8.89,-3.81; 16 -6.35,-3.81; 17 -8.89,-6.35; 18 -6.35,-8.89; 19 -6.35,-6.35; 20 -3.81,-8.89; 21 -3.81,-6.35; 22 -1.27,-8.89; 23 -1.27,-6.35; 24 1.27,-8.89; 25 1.27,-6.35; 26 3.81,-8.89; 27 3.81,-6.35; 28 6.35,-8.89; 29 8.89,-6.35; 30 6.35,-6.35; 31 8.89,-3.81; 32 6.35,-3.81; 33 8.89,-1.27; 34 6.35,-1.27; 35 8.89,1.27; 36 6.35,1.27; 37 8.89,3.81; 38 6.35,3.81; 39 8.89,6.35; 40 6.35,8.89; 41 6.35,6.35; 42 3.81,8.89; 43 3.81,6.35; 44 1.27,8.89
DIL16 = drill 0.813 long: 1 -8.89,-3.81; 2 -6.35,-3.81; 3 -3.81,-3.81; 4 -1.27,-3.81; 5 1.27,-3.81; 6 3.81,-3.81; 7 6.35,-3.81; 8 8.89,-3.81; 9 8.89,3.81; 10 6.35,3.81; 11 3.81,3.81; 12 1.27,3.81; 13 -1.27,3.81; 14 -3.81,3.81; 15 -6.35,3.81; 16 -8.89,3.81
MA09-2 = drill 1.016 octagon: 1 -10.16,-1.27; 2 -10.16,1.27; 3 -7.62,-1.27; 4 -7.62,1.27; 5 -5.08,-1.27; 6 -5.08,1.27; 7 -2.54,-1.27; 8 -2.54,1.27; 9 0,-1.27; 10 0,1.27; 11 2.54,-1.27; 12 2.54,1.27; 13 5.08,-1.27; 14 5.08,1.27; 15 7.62,-1.27; 16 7.62,1.27; 17 10.16,-1.27; 18 10.16,1.27
MA06-1 = drill 1.016 long: 1 -6.35,0; 2 -3.81,0; 3 -1.27,0; 4 1.27,0; 5 3.81,0; 6 6.35,0
MA05-2 = drill 1.016 octagon: 1 -5.08,-1.27; 2 -5.08,1.27; 3 -2.54,-1.27; 4 -2.54,1.27; 5 0,-1.27; 6 0,1.27; 7 2.54,-1.27; 8 2.54,1.27; 9 5.08,-1.27; 10 5.08,1.27
M0805 = smd 1.3 x 1.6: 1 -0.95,0; 2 0.95,0
DIL0814S = drill 0.813 long: 1 -7.62,-3.81; 7 7.62,-3.81; 8 7.62,3.81; 14 -7.62,3.81 | drill 0.8 round: 2 -5.08,-3.81; 3 -2.54,-3.81; 5 2.54,-3.81; 6 5.08,-3.81; 9 5.08,3.81; 10 2.54,3.81; 12 -2.54,3.81; 13 -5.08,3.81 | drill 0.8 long: 4 0,-3.81; 11 0,3.81

### Placement (x,y rotation side)
C1  39.37,40.64 180 bottom
C2  84.45,40.64 180 bottom
C3  3.81,84.45 90 top
C4  29.84,84.45 90 top
C5  11.43,26.67 0 top
C6  13.34,30.48 0 top
C7  55.24,84.45 90 top
C8  30.48,14.61 0 top
C9  54.61,13.34 90 bottom
C10  39.37,42.55 0 bottom
C11  84.45,42.55 0 bottom
C12  5.71,70.48 0 top
C13  17.14,70.48 0 top
C14  31.11,70.48 0 top
C15  42.55,70.48 0 top
C16  56.52,70.48 0 top
C17  67.94,70.48 0 top
C18  11.43,70.48 0 top
C19  36.83,70.48 0 top
C20  62.23,70.48 0 top
C21  22.86,70.48 0 top
C22  48.26,70.48 0 top
C23  73.66,70.48 0 top
C24  5.08,92.08 0 top
C25  30.48,92.08 0 top
C26  55.24,92.08 0 top
C27  133.35,92.71 0 top
C28  143.51,7.62 0 top
C29  142.24,92.71 0 top
EXP  0,49.53 0 top
H1  -60.96,182.88 0 top  (outside the outline)
H2  -67.31,182.88 0 top  (outside the outline)
H3  -73.66,182.88 0 top  (outside the outline)
H4  -80.01,182.88 0 top  (outside the outline)
IC1  139.06,67.31 270 bottom
IC2  142.88,15.24 90 top
IC3  134.62,27.94 270 top
IC4  39.37,39.37 0 top
IC5  83.82,40.01 0 top
IC6  16.51,81.28 0 top
IC7  41.91,81.28 0 top
IC8  67.31,81.28 0 top
JP1  137.16,48.9 90 top
JP2  129.54,48.9 90 top
P1  92.08,93.98 0 top
P2  17.78,92.71 0 top
P3  43.18,92.71 0 top
P4  68.58,92.71 0 top
R1  61.59,38.1 0 bottom
R2  109.86,38.1 0 bottom
R3  57.78,24.13 90 bottom
R4  33.66,5.08 0 top
XTAL1  62.23,13.34 0 top

### Tracks (layer width: path | path; a pad name or v marks a point on that pad's centre or on a via)
!CD3  (1 unrouted)
!CS0  (via drill 0.3)
  Top 0.305: v33.02,20.95 v118.11,20.95
  Bottom 0.305: IC4.16 31.75,34.29 31.75,22.23 v33.02,20.95 | v118.11,20.95 118.11,62.87 120.65,65.41 IC1.11
!CS1  (via drill 0.3)
  Top 0.305: v31.75,19.68 v120.02,19.68
  Bottom 0.305: IC4.17 30.48,20.95 v31.75,19.68 | v120.02,19.68 120.02,62.23 121.92,64.14 IC1.10
!CS2  (via drill 0.3)
  Top 0.305: v121.92,32.38 119.38,29.84 v78.74,29.84
  Bottom 0.305: IC1.9 123.19,62.87 121.92,61.59 v121.92,32.38 | v78.74,29.84 78.74,34.92 IC5.16
!CS3  (via drill 0.3)
  Top 0.305: v75.56,29.84 76.2,29.21 120.02,29.21 v124.46,33.66
  Bottom 0.305: IC5.17 74.93,30.48 v75.56,29.84 | v124.46,33.66 124.46,60.33 125.73,61.59 137.79,61.59 140.34,64.14 IC1.7
!CTS0  (via drill 0.3)  (1 unrouted)
  Top 0.305: v27.3,67.31 v44.45,67.31
  Bottom 0.305: IC6.9 25.4,81.92 26.67,80.64 26.67,67.94 v27.3,67.31
!CTS1  (via drill 0.3)
  Top 0.305: v54.61,50.8 v48.9,50.8 | IC4.28 v52.7,30.48
  Bottom 0.305: IC7.9 50.8,81.92 52.07,80.64 52.07,66.67 48.9,63.5 v48.9,50.8 | v54.61,50.8 54.61,32.38 v52.7,30.48
!CTS2  (1 unrouted)
!INTRN0  (via drill 0.3)
  Top 0.305: IC3.4 132.72,27.94 133.35,28.57 133.35,29.21 | 133.35,29.21 133.35,29.84 132.72,30.48 IC3.2 | 133.35,29.21 v135.25,29.21
  Bottom 0.406: JP1.1 138.43,36.83 135.25,33.66 v135.25,29.21
  Bottom 0.61: JP1.17 JP1.15 JP1.13 JP1.11 JP1.9 JP1.7 JP1.5 JP1.3 JP1.1
!INTRN1  (via drill 0.3)
  Top 0.305: IC3.6 133.99,25.4 v134.62,24.77 135.25,24.13 IC3.8
  Bottom 0.406: JP2.1 130.81,36.83 133.35,34.29 133.35,26.04 v134.62,24.77
  Bottom 0.61: JP2.1 JP2.3 JP2.5 JP2.7 JP2.9 JP2.11 JP2.13 JP2.15 JP2.17
!IRQ  (via drill 0.3)
  Top 0.305: JP2.2 129.54,37.47 134.62,37.47 JP1.2 137.16,40.01 140.97,40.01 142.24,38.73 v146.05,38.73
  Bottom 0.305: EXP.C29 148.59,17.78 147.32,19.05 147.32,37.47 v146.05,38.73
!IRQ0  (via drill 0.3)
  Top 0.305: JP2.18 129.54,57.78 134.62,57.78 JP1.18 137.16,60.33 139.7,60.33 140.34,59.69 v145.41,59.69 | v145.41,45.72 EXP.C18
  Bottom 0.305: v145.41,59.69 v145.41,45.72
!IRQ1  (via drill 0.3)
  Top 0.305: JP2.16 129.54,55.24 134.62,55.24 JP1.16 137.16,57.78 139.7,57.78 140.34,58.42 v144.15,58.42 | v144.78,43.18 EXP.C19
  Bottom 0.305: v144.78,43.18 144.78,57.78 v144.15,58.42
!IRQ2  (via drill 0.3)
  Top 0.305: JP2.14 129.54,52.7 134.62,52.7 JP1.14 137.16,55.24 139.7,55.24 140.34,55.88 v143.51,55.88 | v144.78,40.64 EXP.C20
  Bottom 0.305: v144.78,40.64 143.51,41.91 143.51,43.81 144.15,44.45 144.15,55.24 v143.51,55.88
!IRQ3  (via drill 0.3)
  Top 0.305: JP2.12 129.54,50.16 134.62,50.16 JP1.12 137.16,52.7 139.7,52.7 v140.34,53.34 | EXP.A13 153.67,57.15 v140.34,57.15
  Bottom 0.305: v140.34,53.34 v140.34,57.15
!IRQ4  (via drill 0.3)
  Top 0.305: JP2.10 129.54,47.62 134.62,47.62 JP1.10 137.16,50.16 v140.34,50.16 | EXP.A14 153.67,54.61 v141.6,54.61
  Bottom 0.305: v140.34,50.16 140.97,50.8 140.97,52.7 141.6,53.34 v141.6,54.61
!IRQ5  (via drill 0.3)
  Top 0.305: JP2.8 129.54,45.09 134.62,45.09 JP1.8 137.16,47.62 v141.6,47.62 | EXP.A15 153.67,52.07 v142.88,52.07
  Bottom 0.305: v141.6,47.62 142.24,48.26 142.24,50.8 142.88,51.44 v142.88,52.07
!IRQ6  (via drill 0.3)
  Top 0.305: JP2.6 129.54,42.55 134.62,42.55 JP1.6 137.16,45.09 139.7,45.09 v140.34,45.72 | EXP.A16 153.67,49.53 141.6,49.53 v140.97,48.9
  Bottom 0.305: v140.34,45.72 140.34,48.26 v140.97,48.9
!IRQ7
  Top 0.305: JP2.4 129.54,40.01 134.62,40.01 JP1.4 137.16,42.55 140.34,42.55 142.24,44.45 153.67,44.45 EXP.A18
!R  (via drill 0.3)  (1 unrouted)
  Top 0.305: v41.27,25.4 v85.09,25.4
  Bottom 0.305: IC4.24 40.64,26.04 v41.27,25.4 | v85.09,25.4 IC5.24
!RESET
  Top 0.305: IC2.2 EXP.C30
!RTS0  (via drill 0.3)  (1 unrouted)
  Top 0.305: v26.04,66.04 v45.72,66.04
  Bottom 0.305: IC6.10 22.86,80.64 24.13,79.38 24.13,74.3 26.04,72.39 v26.04,66.04
!RTS1
  Bottom 0.305: IC7.10 48.26,80.64 49.53,79.38 49.53,73.66 50.8,72.39 50.8,67.31 47.62,64.14 47.62,53.98 44.45,50.8 44.45,41.27 43.81,40.64 43.81,33.66 IC4.27
!RTS2  (1 unrouted)
!RTS3  (1 unrouted)
!SYSDEV  (1 unrouted)
!W  (via drill 0.3)  (1 unrouted)
  Top 0.305: v36.2,23.5 v80.01,23.5
  Bottom 0.305: IC4.20 35.56,24.13 v36.2,23.5 | v80.01,23.5 IC5.20
+3.3V  (2 unrouted)
+12V  (2 unrouted)
AB0  (via drill 0.3)
  Top 0.305: EXP.A5 153.67,77.47 116.84,77.47 102.87,63.5 v95.25,63.5 v50.8,63.5
  Bottom 0.305: IC4.31 50.8,38.1 v50.8,63.5 | IC5.31 95.25,38.73 v95.25,63.5
AB1  (via drill 0.3)
  Top 0.305: EXP.A6 153.67,74.93 118.11,74.93 104.14,60.96 v96.52,60.96 v52.07,60.96
  Bottom 0.305: IC4.30 46.99,34.29 48.9,34.29 52.07,37.47 v52.07,60.96 | IC5.30 91.44,34.92 93.34,34.92 96.52,38.1 v96.52,60.96
AB2  (via drill 0.3)
  Top 0.305: EXP.A7 153.67,72.39 119.38,72.39 105.41,58.42 v97.79,58.42 v53.34,58.42
  Bottom 0.305: v53.34,58.42 53.34,36.83 49.53,33.02 IC4.29 | IC5.29 93.98,33.66 97.79,37.47 v97.79,58.42
AB3
  Bottom 0.254: EXP.A8 153.67,72.39 146.69,72.39 146.05,71.75 IC1.1
AB4
  Bottom 0.254: EXP.A9 153.67,69.85 146.69,69.85 146.05,70.48 IC1.2
AB5
  Bottom 0.254: EXP.A10 153.67,67.31 147.32,67.31 145.41,69.22 IC1.3
AB6
  Bottom 0.254: EXP.A11 153.67,64.77 146.05,64.77 145.41,65.41 IC1.6
AB7
  Bottom 0.254: EXP.A12 153.67,62.23 147.32,62.23 144.78,64.77 140.34,64.77 140.34,67.94 IC1.4
CTS0
  Bottom 0.305: P2.8 21.59,92.71 21.59,88.9 24.13,86.36 24.13,81.28 25.4,80.01 IC6.8
CTS1
  Bottom 0.305: P3.8 46.99,92.71 46.99,88.9 49.53,86.36 49.53,81.28 50.8,80.01 IC7.8
CTS2
  Bottom 0.305: P4.8 72.39,92.71 72.39,89.53 74.93,87 74.93,81.28 76.2,80.01 IC8.8
DB0  (via drill 0.3)
  Top 0.305: v33.66,64.14 34.29,64.77 v76.2,64.77 102.23,64.77 116.2,78.74 EXP.C5
  Bottom 0.305: v76.2,64.77 76.2,45.09 IC5.9 | IC4.9 31.75,44.45 31.75,62.23 v33.66,64.14
DB1  (via drill 0.3)
  Top 0.305: v34.92,61.59 35.56,62.23 v78.74,62.23 103.5,62.23 117.47,76.2 EXP.C6
  Bottom 0.305: v78.74,62.23 78.74,47.62 IC5.8 | IC4.8 34.29,46.99 34.29,60.96 v34.92,61.59
DB2  (via drill 0.3)
  Top 0.305: IC4.7 30.48,53.34 36.83,59.69 v74.93,59.69 104.78,59.69 118.75,73.66 EXP.C7
  Bottom 0.305: v74.93,59.69 IC5.7
DB3  (via drill 0.3)
  Top 0.305: EXP.C8 120.02,71.12 106.05,57.15 v77.47,57.15 37.47,57.15 33.02,52.7 IC4.6
  Bottom 0.305: v77.47,57.15 IC5.6
DB4  (via drill 0.3)
  Top 0.305: EXP.C9 119.38,68.58 106.68,55.88 v81.28,55.88 38.1,55.88 v37.47,55.24
  Bottom 0.305: IC5.5 81.28,47.62 v81.28,55.88 | IC4.5 36.83,46.99 36.83,54.61 v37.47,55.24
DB5  (via drill 0.3)  (1 unrouted)
  Top 0.305: 149.22,66.04 EXP.C10 | 118.75,66.04 107.31,54.61 v80.01,54.61 39.37,54.61 35.56,50.8 IC4.4
  Bottom 0.305: v80.01,54.61 IC5.4
DB6  (via drill 0.3)
  Top 0.305: EXP.C11 147.96,63.5 147.32,64.14 118.75,64.14 107.95,53.34 v83.82,53.34 v41.27,53.34
  Bottom 0.305: IC5.3 83.82,47.62 v83.82,53.34 | IC4.3 39.37,46.99 39.37,51.44 v41.27,53.34
DB7  (via drill 0.3)
  Top 0.305: EXP.C12 148.59,60.96 146.69,62.87 119.38,62.87 108.58,52.07 v82.55,52.07 40.01,52.07 38.1,50.16 IC4.2
  Bottom 0.305: v82.55,52.07 IC5.2
GND  (via drill 0.3)
  Top 0.305: IC3.7 v133.35,24.13 | IC3.13 v139.32,30.48 | IC2.3 144.16,17.76 v144.15,17.78 | C8.2 v33.02,14.61 | R4.1 v31.11,5.08 | C6.1 v10.79,30.48 | v8.89,26.67 C5.1
  Top 0.61: C3.1 v3.81,81.92 | C4.1 v29.84,81.92 | C7.1 v55.24,81.92
  pour Bottom (isolate 0.305, rank 6, no thermals): 0,100.33 160.02,100.33 160.02,0 0,0
INT0  (via drill 0.3)  (1 unrouted)
  Top 0.305: v57.78,38.1 IC4.33 | v57.78,28.57 120.65,28.57 124.46,31.75 IC3.1
  Bottom 0.305: v57.78,28.57 v57.78,38.1
INT1  (via drill 0.3)  (1 unrouted)
  Top 0.305: IC3.3 123.19,29.21 121.28,27.3 v56.52,27.3 | v56.52,35.56 50.16,35.56 48.9,34.29 46.99,34.29 IC4.32
  Bottom 0.305: v56.52,35.56 v56.52,27.3
INT2  (via drill 0.3)  (1 unrouted)
  Top 0.305: IC3.5 124.46,26.67 123.19,25.4 v102.87,25.4 | v102.87,38.73 IC5.33
  Bottom 0.305: v102.87,25.4 v102.87,38.73
INT3  (via drill 0.3)  (1 unrouted)
  Top 0.305: IC3.9 135.89,25.4 133.99,27.3 123.19,27.3 122.56,26.67 v101.6,26.67 | IC5.32 v101.6,36.2
  Bottom 0.305: v101.6,36.2 v101.6,26.67
N$829
  Bottom 0.305: IC6.1 7.62,74.93 4.45,71.75 C12.+
N$830
  Bottom 0.305: IC6.3 12.7,78.11 12.06,78.74 9.53,78.74 8.89,78.11 8.89,73.66 6.99,71.75 C12.-
N$831
  Bottom 0.305: C13.+ 15.88,71.75 15.24,72.39 IC6.4
N$832
  Bottom 0.305: IC6.5 17.78,73.66 18.41,73.03 C13.-
N$833
  Bottom 0.305: IC6.6 20.32,75.56 24.13,71.75 C21.-
N$834
  Bottom 0.305: C18.+ IC6.2
N$836
  Bottom 0.305: IC7.1 33.02,73.66 C14.+
N$837
  Bottom 0.305: IC7.3 38.1,78.11 37.47,78.74 34.92,78.74 34.29,78.11 34.29,72.39 C14.-
N$838
  Bottom 0.305: IC7.4 40.64,72.39 41.27,71.75 C15.+
N$839
  Bottom 0.305: IC7.5 43.18,74.3 43.81,73.66 C15.-
N$840
  Bottom 0.305: IC7.6 45.72,75.56 49.53,71.75 C22.-
N$841
  Bottom 0.305: C19.+ IC7.2
N$851
  Bottom 0.305: IC8.1 58.42,73.66 C16.+
N$852
  Bottom 0.305: IC8.3 63.5,78.11 62.87,78.74 60.33,78.74 59.69,78.11 59.69,72.39 C16.-
N$853
  Bottom 0.305: IC8.4 66.04,71.12 C17.+
N$854
  Bottom 0.305: IC8.5 68.58,71.12 C17.-
N$855
  Bottom 0.305: IC8.6 71.12,74.3 C23.-
N$856
  Bottom 0.305: C20.+ IC8.2
RTS0
  Bottom 0.305: P2.7 20.32,88.27 21.59,87 21.59,80.01 22.86,78.74 IC6.7
RTS1
  Bottom 0.305: P3.7 45.72,88.27 46.99,87 46.99,80.01 48.26,78.74 IC7.7
RTS2
  Bottom 0.305: P4.7 71.12,88.27 72.39,87 72.39,80.01 73.66,78.74 IC8.7
RX0  (via drill 0.3)
  Top 0.305: v17.14,40.64 IC4.11
  Bottom 0.305: IC6.12 17.78,82.55 16.51,81.28 16.51,73.03 17.14,72.39 v17.14,40.64
RX1  (via drill 0.3)
  Top 0.305: v42.55,58.42 36.83,58.42 31.75,53.34 31.75,44.45 IC4.10
  Bottom 0.305: IC7.12 43.18,82.55 41.91,81.28 41.91,73.66 42.55,73.03 v42.55,58.42
RX2  (1 unrouted)
RX3  (1 unrouted)
RXD0
  Bottom 0.305: P2.2 13.97,92.71 13.97,89.53 11.43,87 11.43,83.19 12.06,82.55 14.61,82.55 15.24,83.19 IC6.13
RXD1
  Bottom 0.305: P3.2 39.37,92.71 39.37,88.9 36.83,86.36 36.83,83.19 37.47,82.55 40.01,82.55 40.64,83.19 IC7.13
RXD2
  Bottom 0.305: P4.2 64.77,92.71 64.77,88.9 62.23,86.36 62.23,83.19 62.87,82.55 65.41,82.55 66.04,83.19 IC8.13
TX0  (via drill 0.3)
  Top 0.305: v22.86,38.1 IC4.13
  Bottom 0.305: IC6.11 20.32,81.28 19.05,80.01 19.05,74.93 22.86,71.12 v22.86,38.1
TX1  (via drill 0.3)
  Top 0.305: v33.66,68.58 v45.72,68.58 | v27.94,39.37 31.75,39.37 IC4.14
  Bottom 0.305: IC7.11 45.72,81.28 44.45,80.01 44.45,74.93 45.72,73.66 v45.72,68.58 | v33.66,68.58 27.94,62.87 v27.94,39.37
TX2  (1 unrouted)
TX3  (1 unrouted)
TXD0
  Bottom 0.305: IC6.14 12.7,86.36 15.24,88.9 P2.3
TXD1
  Bottom 0.305: P3.3 40.64,88.27 38.1,85.72 IC7.14
TXD2
  Bottom 0.305: P4.3 66.04,88.27 63.5,85.72 IC8.14
UARTCLK  (via drill 0.3)
  Top 0.305: 107.31,22.23 v77.47,22.23 v69.85,22.23 v34.29,22.23
  Bottom 0.305: v77.47,22.23 IC5.18 | v34.29,22.23 33.02,23.5 IC4.18 | v69.85,22.23 XTAL1.8
  Bottom 0.61: XTAL1.11 62.23,15.24 62.87,14.61 69.22,14.61 69.85,15.24 XTAL1.8
UARTRST  (via drill 0.3)
  Top 0.305: IC2.4 126.69,16.19 118.75,24.13 v99.69,24.13 v55.24,24.13 | v99.69,46.35 IC5.39 | v55.24,45.72 IC4.39
  Bottom 0.305: v99.69,24.13 v99.69,46.35 | v55.24,24.13 v55.24,45.72
VCC  (via drill 0.3)  (1 unrouted)
  Bottom 0.61: v41.91,42.55 C10.1 C1.2 | v87,42.55 C11.1 C2.2 | C9.2 XTAL1.14
  pour Top (isolate 0.305, rank 6): 0,100.33 160.02,100.33 160.02,0 0,0